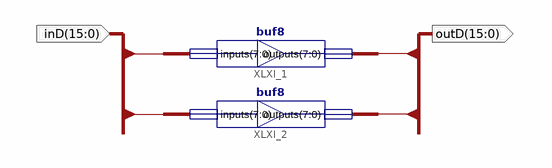
[diagram p0: schematic sheet 1]
// Xilinx ISE schematic buf16.sch (spartan6) as structural Verilog: 2 symbols, 2 ports
module buf16 (
  input  [15:0] inD,
  output [15:0] outD
);

  buf8 XLXI_1 (.inputs(inD[7:0]), .outputs(outD[7:0]));
  buf8 XLXI_2 (.inputs(inD[15:8]), .outputs(outD[15:8]));
endmodule
